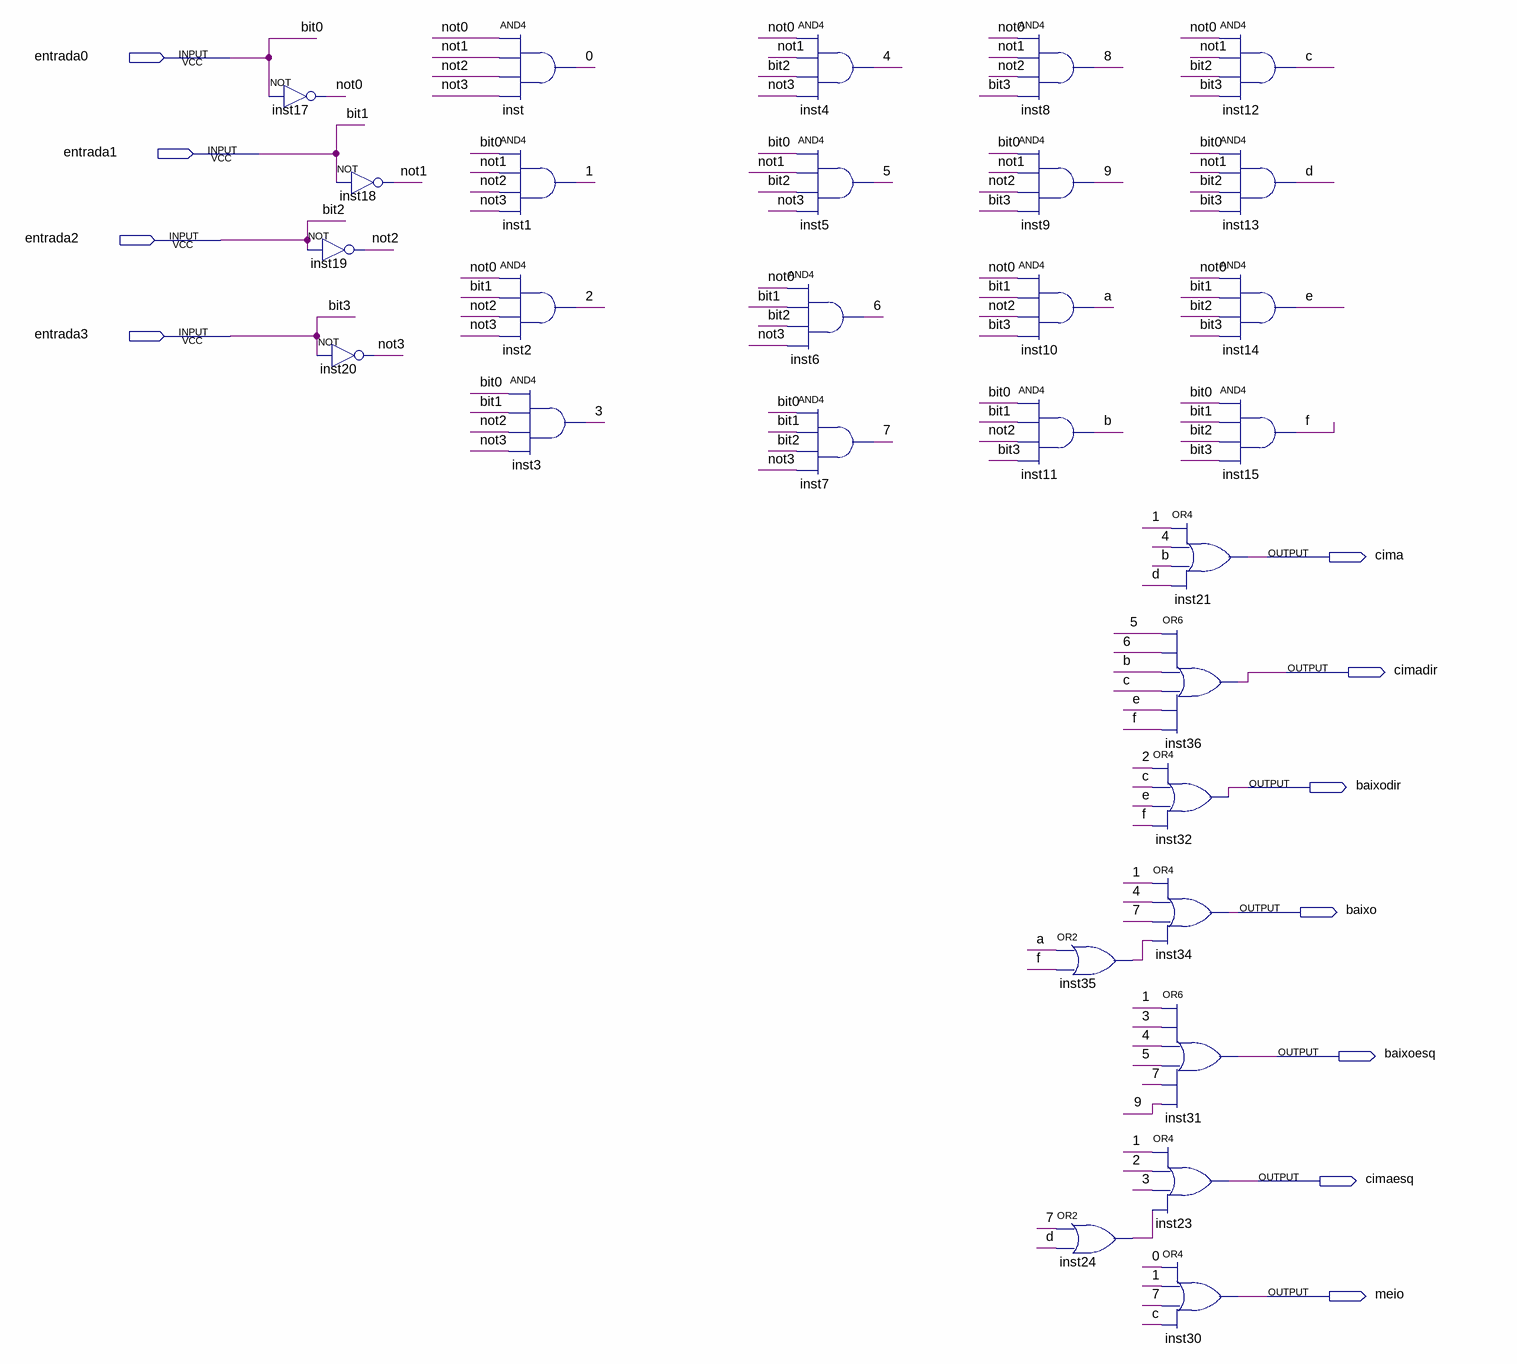
[diagram p0: schematic sheet]
// Quartus schematic display.bdf as structural Verilog: 29 symbols, 11 pins
module display (
  input  entrada0,
  input  entrada1,
  input  entrada2,
  input  entrada3,
  output cima,
  output cimadir,
  output baixodir,
  output baixo,
  output baixoesq,
  output cimaesq,
  output meio
);

  wire \0 , \1 , \2 , \3 , \4 , \5 , \6 , \7 , \8 , \9 , a, b, c, d, e, f, inst24_out, inst35_out, not0,
       not1, not2, not3;

  not inst17 (not0, entrada0);
  not inst19 (not2, entrada2);
  not inst20 (not3, entrada3);
  not inst18 (not1, entrada1);
  and inst (\0 , not0, not1, not2, not3);
  and inst1 (\1 , entrada0, not1, not2, not3);
  and inst2 (\2 , not0, entrada1, not2, not3);
  and inst3 (\3 , entrada0, entrada1, not2, not3);
  and inst4 (\4 , not0, not1, entrada2, not3);
  and inst5 (\5 , entrada0, not1, entrada2, not3);
  and inst6 (\6 , not0, entrada1, entrada2, not3);
  and inst7 (\7 , entrada0, entrada1, entrada2, not3);
  and inst8 (\8 , not0, not1, not2, entrada3);
  and inst9 (\9 , entrada0, not1, not2, entrada3);
  and inst10 (a, not0, entrada1, not2, entrada3);
  and inst11 (b, entrada0, entrada1, not2, entrada3);
  or inst35 (inst35_out, a, f);
  or inst24 (inst24_out, \7 , d);
  or inst36 (cimadir, \5 , \6 , b, c, e, f);
  or inst32 (baixodir, \2 , c, e, f);
  or inst34 (baixo, \1 , \4 , \7 , inst35_out);
  or inst31 (baixoesq, \1 , \3 , \4 , \5 , \7 , \9 );
  or inst23 (cimaesq, \1 , \2 , \3 , inst24_out);
  or inst30 (meio, \0 , \1 , \7 , c);
  and inst12 (c, not0, not1, entrada2, entrada3);
  and inst13 (d, entrada0, not1, entrada2, entrada3);
  and inst14 (e, not0, entrada1, entrada2, entrada3);
  and inst15 (f, entrada0, entrada1, entrada2, entrada3);
  or inst21 (cima, \1 , \4 , b, d);

  // Other names for the same wires on the sheet: bit0 = entrada0; bit1 = entrada1; bit2 = entrada2; bit3 = entrada3
endmodule
